# Altium schematic sheet CANLink_revA.SchDoc
size B; SheetNumber: 1; SheetTotal: 5
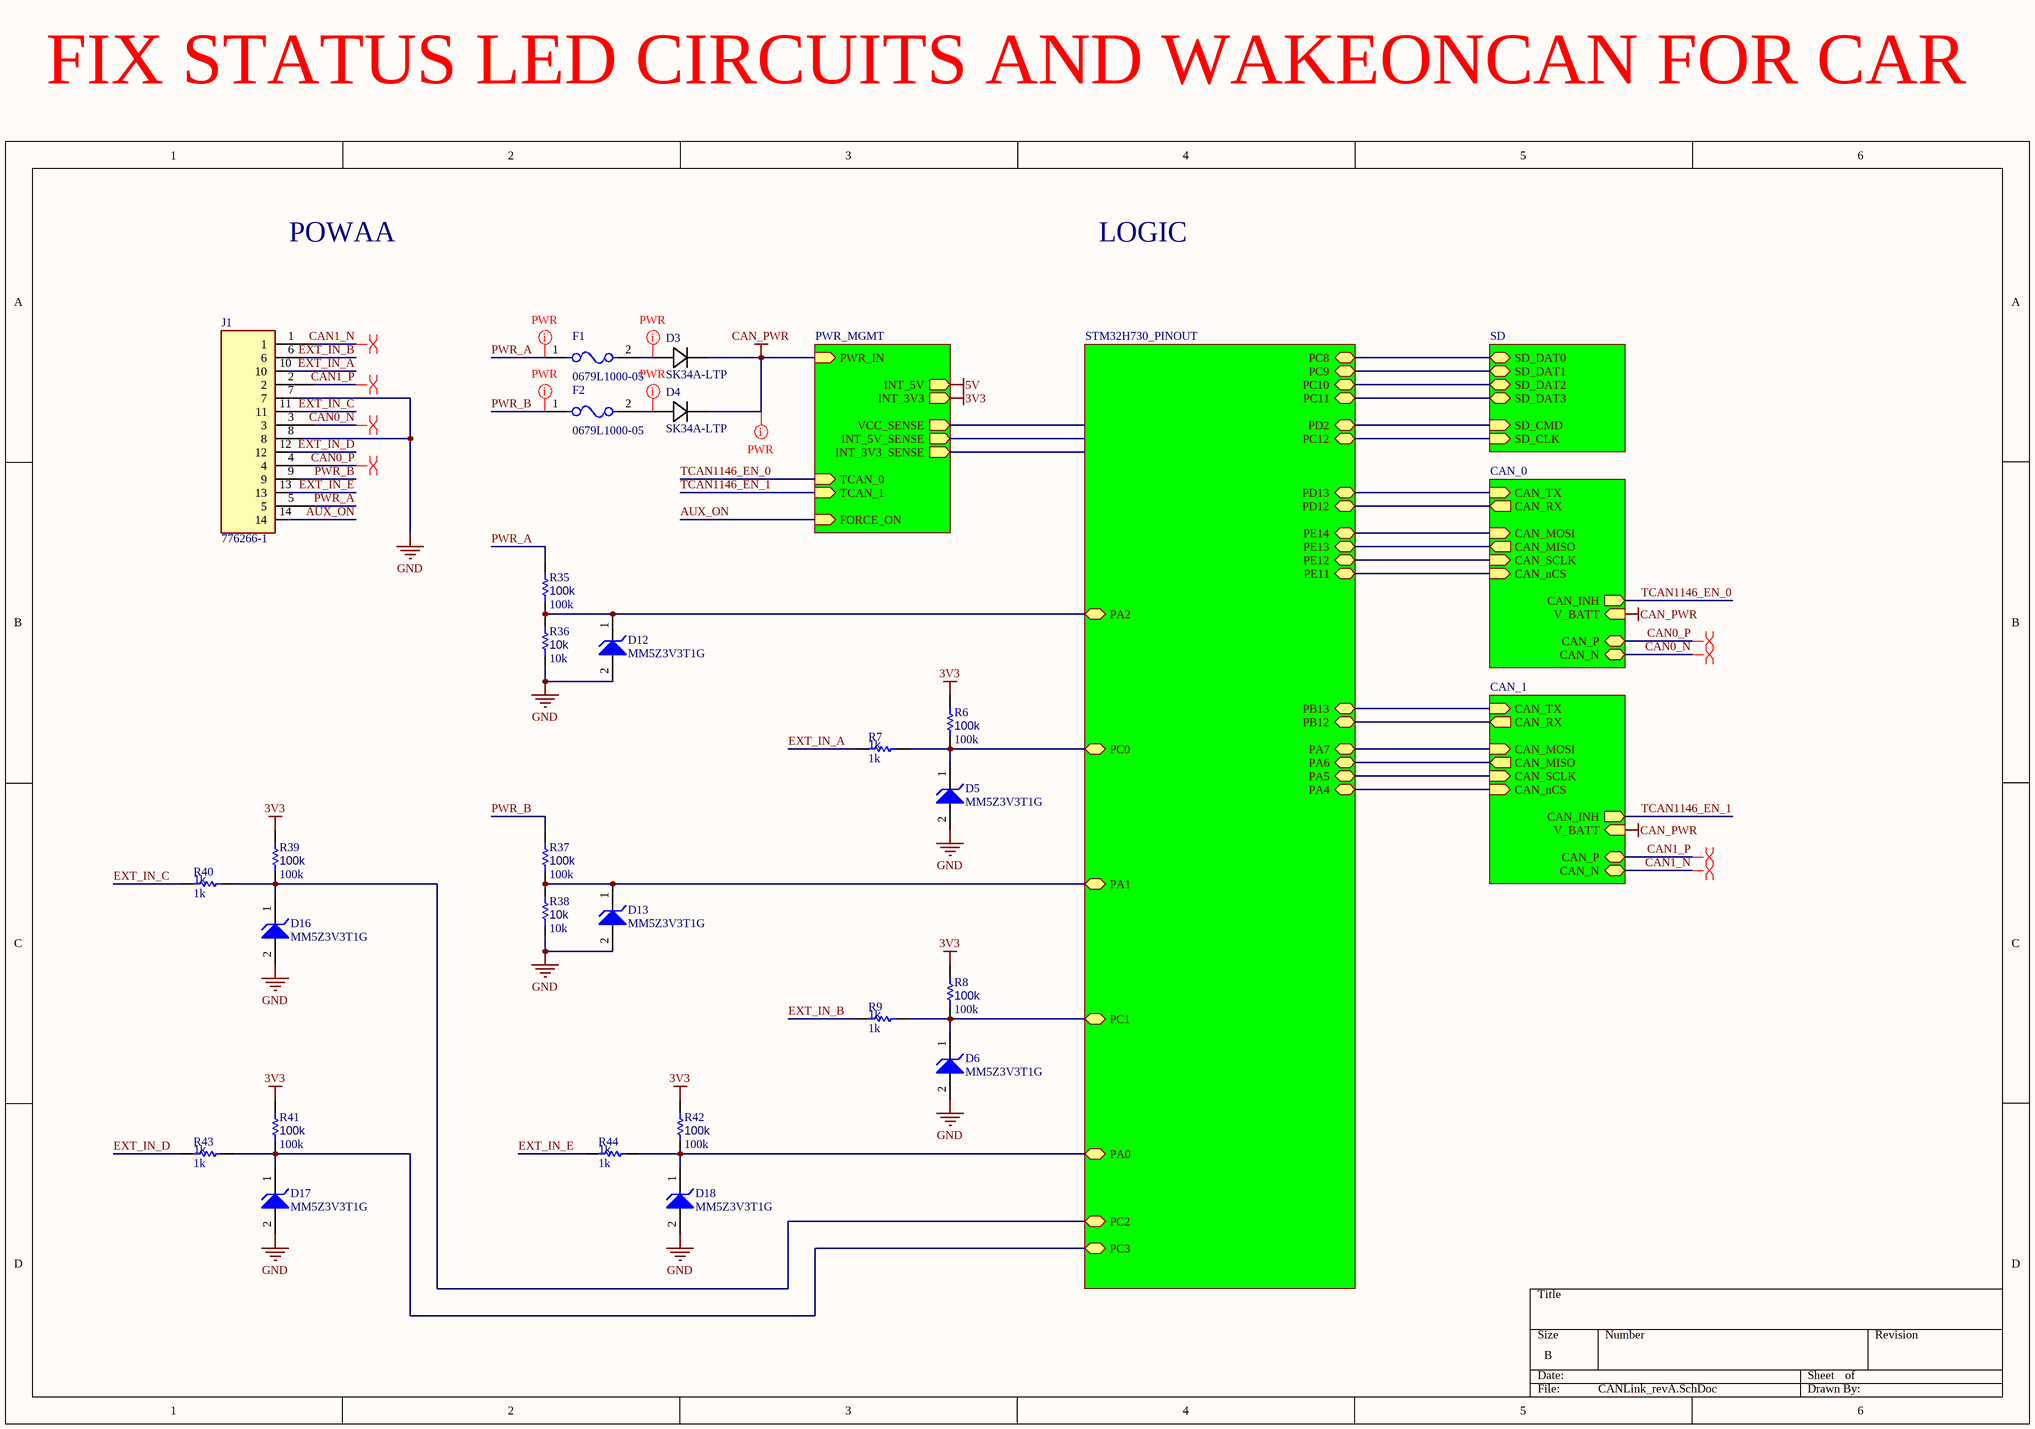
[diagram p0: CANLink_revA.SchDoc]

## Parts
D3  SK34A-LTP  [SK34A-LTP-Footprint-1]
D4  SK34A-LTP  [SK34A-LTP-Footprint-1]
D5  MM5Z3V3T1G  [ONSC-SOD-523-2-502-01_V]
D6  MM5Z3V3T1G  [ONSC-SOD-523-2-502-01_V]
D12  MM5Z3V3T1G  [ONSC-SOD-523-2-502-01_V]
D13  MM5Z3V3T1G  [ONSC-SOD-523-2-502-01_V]
D16  MM5Z3V3T1G  [ONSC-SOD-523-2-502-01_V]
D17  MM5Z3V3T1G  [ONSC-SOD-523-2-502-01_V]
D18  MM5Z3V3T1G  [ONSC-SOD-523-2-502-01_V]
F1  0679L1000-05  [FP-0679L-MFG]
F2  0679L1000-05  [FP-0679L-MFG]
J1  776266-1  [776266-1-Footprint-1]
R6  100k  [R0603B]
R7  1k  [R0603B]
R8  100k  [R0603B]
R9  1k  [R0603B]
R35  100k  [R0603B]
R36  10k  [R0603B]
R37  100k  [R0603B]
R38  10k  [R0603B]
R39  100k  [R0603B]
R40  1k  [R0603B]
R41  100k  [R0603B]
R42  100k  [R0603B]
R43  1k  [R0603B]
R44  1k  [R0603B]

## Sub-sheets
CAN_0 = TCAN1146_PINOUT: CAN_TX (in), CAN_RX (out), CAN_SCLK (in), CAN_MISO (out), CAN_MOSI (in), CAN_nCS (in), CAN_INH (out), V_BATT (in), CAN_P (bidir), CAN_N (bidir)
CAN_1 = TCAN1146_PINOUT: CAN_TX (in), CAN_RX (out), CAN_SCLK (in), CAN_MISO (out), CAN_MOSI (in), CAN_nCS (in), CAN_INH (out), V_BATT (in), CAN_P (bidir), CAN_N (bidir)
MCU_0 = STM32H730_PINOUT: PB12 (bidir), PB13 (bidir), PA4 (bidir), PA5 (bidir), PA6 (bidir), PA7 (bidir), PD12 (bidir), PD13 (bidir), PE11 (bidir), PE12 (bidir), PE13 (bidir), PE14 (bidir), PC9 (bidir), PC10 (bidir), PC11 (bidir), PC12 (bidir), PD2 (bidir), PC8 (bidir), PA0 (bidir), PA1 (bidir), PA2 (bidir), PC2 (bidir), PC3 (bidir), PC1 (bidir), PC0 (bidir)
PWR_MGMT = PWR_MGMT: PWR_IN (in), INT_3V3 (out), VCC_SENSE (out), INT_3V3_SENSE (out), FORCE_ON (in), TCAN_0 (in), TCAN_1 (in), INT_5V (out), INT_5V_SENSE (out)
SD_0 = SD: SD_DAT0 (bidir), SD_DAT1 (bidir), SD_DAT2 (bidir), SD_DAT3 (bidir), SD_CMD (in), SD_CLK (in)

## Nets
3V3: R6.1 R8.1 R39.1 R41.1 R42.1 ; sheet PWR_MGMT/INT_3V3
5V: sheet PWR_MGMT/INT_5V
CAN_PWR: D3.1(CATHODE) D4.1(CATHODE) ; sheet CAN_1/V_BATT, sheet PWR_MGMT/PWR_IN, sheet CAN_0/V_BATT
GND: D5.2(A) D6.2(A) D12.2(A) D13.2(A) D16.2(A) D17.2(A) D18.2(A) J1.7 J1.8 R36.2 R38.2
AUX_ON: J1.14 ; sheet PWR_MGMT/FORCE_ON
CAN0_N: J1.3 ; sheet CAN_0/CAN_N
CAN0_P: J1.4 ; sheet CAN_0/CAN_P
CAN1_N: J1.1 ; sheet CAN_1/CAN_N
CAN1_P: J1.2 ; sheet CAN_1/CAN_P
EXT_IN_A: J1.10 R7.2
EXT_IN_B: J1.6 R9.2
EXT_IN_C: J1.11 R40.2
EXT_IN_D: J1.12 R43.2
EXT_IN_E: J1.13 R44.2
PWR_A: F1.1 J1.5 R35.1
PWR_B: F2.1 J1.9 R37.1
TCAN1146_EN_0: sheet PWR_MGMT/TCAN_0, sheet CAN_0/CAN_INH
TCAN1146_EN_1: sheet CAN_1/CAN_INH, sheet PWR_MGMT/TCAN_1
NetD3_2: D3.2(ANODE) F1.2
NetD4_2: D4.2(ANODE) F2.2
NetD5_1: D5.1(K) R6.2 R7.1 ; sheet MCU_0/PC0
NetD6_1: D6.1(K) R8.2 R9.1 ; sheet MCU_0/PC1
NetD12_1: D12.1(K) R35.2 R36.1 ; sheet MCU_0/PA2
NetD13_1: D13.1(K) R37.2 R38.1 ; sheet MCU_0/PA1
NetD16_1: D16.1(K) R39.2 R40.1 ; sheet MCU_0/PC2
NetD17_1: D17.1(K) R41.2 R43.1 ; sheet MCU_0/PC3
NetD18_1: D18.1(K) R42.2 R44.1 ; sheet MCU_0/PA0
(unnamed): sheet MCU_0/PB12, sheet CAN_1/CAN_RX
(unnamed): sheet MCU_0/PB13, sheet CAN_1/CAN_TX
(unnamed): sheet MCU_0/PA4, sheet CAN_1/CAN_nCS
(unnamed): sheet MCU_0/PA5, sheet CAN_1/CAN_SCLK
(unnamed): sheet MCU_0/PA6, sheet CAN_1/CAN_MISO
(unnamed): sheet MCU_0/PA7, sheet CAN_1/CAN_MOSI
(unnamed): sheet MCU_0/PD12, sheet CAN_0/CAN_RX
(unnamed): sheet MCU_0/PD13, sheet CAN_0/CAN_TX
(unnamed): sheet MCU_0/PE11, sheet CAN_0/CAN_nCS
(unnamed): sheet MCU_0/PE12, sheet CAN_0/CAN_SCLK
(unnamed): sheet MCU_0/PE13, sheet CAN_0/CAN_MISO
(unnamed): sheet MCU_0/PE14, sheet CAN_0/CAN_MOSI
(unnamed): sheet MCU_0/PC9, sheet SD_0/SD_DAT1
(unnamed): sheet MCU_0/PC10, sheet SD_0/SD_DAT2
(unnamed): sheet MCU_0/PC11, sheet SD_0/SD_DAT3
(unnamed): sheet MCU_0/PC12, sheet SD_0/SD_CLK
(unnamed): sheet MCU_0/PD2, sheet SD_0/SD_CMD
(unnamed): sheet MCU_0/PC8, sheet SD_0/SD_DAT0

## Layout directives
differential pair: CAN0_N, CAN0_P, CAN1_N, CAN1_P
net class PWR: CAN_PWR, NetD3_2, NetD4_2, PWR_A, PWR_B

## Notes on the sheet
- FIX STATUS LED CIRCUITS AND WAKEONCAN FOR CAR
- POWAA
- LOGIC

## Library data of the parts
D3 D4 = CMP-004-00058-2: Rectifier Diode, Schottky, 1 Phase, 1 Element, 3A, 40V V(RRM), Silicon, DO-214AC; Forward Voltage: 500mV; Max Operating Temperature: 125°C; Pins: 2; RoHS Compliant: Yes
D5 D6 D12 D13 D16-D18 = CMP-1060-00750-1: Zener Voltage Regulator, 500 mW, 2-Pin SOD-523, Pb-Free, Tape and Reel; Manufacturer: On Semiconductor; P Max (W): 0.5; VZ Typ (V): 3.3; RoHS: Pb-Free; ComponentLink2Description: Datasheet; PackageReference: SOD-523-2-502-01; DatasheetVersion: Rev. 10; ComponentLink1Description: Manufacturer URL; PackageVersion: Rev. E, 09/2010; ComponentLink3URL: http://www.onsemi.com/pub_link/Collateral/502-01.PDF; ComponentLink2URL: http://www.onsemi.cn/pub_link/Collateral/MM5Z2V4T1-D.PDF; Mounting Technology: Surface Mount; PartNumber: MM5Z3V3T1G; Packing: Tape and Reel; PackageDescription: 2-Pin SOD, Body 1.2 x 0.8 mm; ComponentLink1URL: http://www.onsemi.com/; ComponentLink3Description: Package Specification
F1 F2 = CMP-16042-000002-1: DIFF P#!!! / FUSE BRD MNT 1A 125VAC/VDC; Manufacturer: Bel Fuse; Manufacturer Part Number: 0679L9150-01; Max Fuse Ac Voltage: 125V; Fuse Blow Speed: Fast; Fuse Current: 15A; Fuse I2T: 103.5A2Sec; Fuse Interrupt Ac Current: 50A; Automotive Grade: Grade 1; Value: 0.0038Ω; Fuse Interrupt Dc Current: 300A; Fuse Voltage Drop: 0.13V; Device Class L2: Fuses; ComponentLink2URL: https://www.belfuse.com/resources/CircuitProtection/datasheets/0679L%20Sep2016.pdf; Package: 0679L; Height: 2.79mm; Digikey Description: FUSE BRD MNT 15A 125VAC/VDC; Temperature Range High: +125°C; Device Class L3: unset; Octopart: https://octopart.com/0679l9150-01-bel+fuse-70850665; Temperature Range Low: -55°C; Max Fuse Dc Voltage: 125V; Ipc Land Pattern Name: CAPC610254X254; Category: Fuse; Lead Free: Yes; Automotive: Yes; Resistance: 0.0038Ω; RoHS: TRUE; Device Class L1: Circuit Protection; ComponentLink2Description: Datasheet; Temperature: -55°C to +125°C; Voltage Rating: 125V
J1 = CMP-002-00087-1: Board Connector; Connector Type: BOARD CONNECTOR; RoHS Compliant: Yes
R6-R9 R35-R44 = CMP-009-00002-14: Resistor
  R6 R8 R35 R37 R39 R41 R42: Value: 100k
  R7 R9 R40 R43 R44: Value: 1k
  R36 R38: Value: 10k